# EAGLE design I2CPCB (EAGLE 8.6.0)
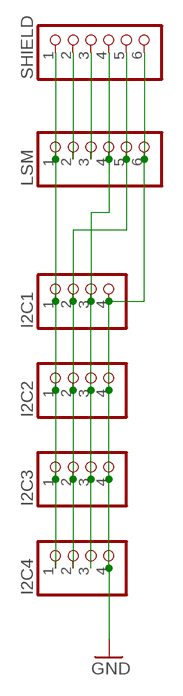
[diagram p0: schematic, sheet 1]

## Parts
I2C1  PINHD-1X4  [1X04]
I2C2  PINHD-1X4  [1X04]
I2C3  PINHD-1X4  [1X04]
I2C4  PINHD-1X4  [1X04]
LSM  PINHD-1X6  [1X06]
SHIELD  PINHD-1X6  [1X06]

## Nets
GND: I2C1.4 I2C2.4 I2C3.4 I2C4.4 LSM.6 SHIELD.6
N$1: I2C1.1 I2C2.1 I2C3.1 I2C4.1 LSM.1 SHIELD.1
N$2: LSM.2 SHIELD.2
N$3: LSM.3 SHIELD.3
N$5: I2C1.2 I2C2.2 I2C3.2 I2C4.2 LSM.5 SHIELD.5
N$6: I2C1.3 I2C2.3 I2C3.3 I2C4.3 LSM.4 SHIELD.4

## Library data of the parts
I2C1-I2C4 = pinhead:PINHD-1X4: PIN HEADER
LSM SHIELD = pinhead:PINHD-1X6: PIN HEADER

## Board
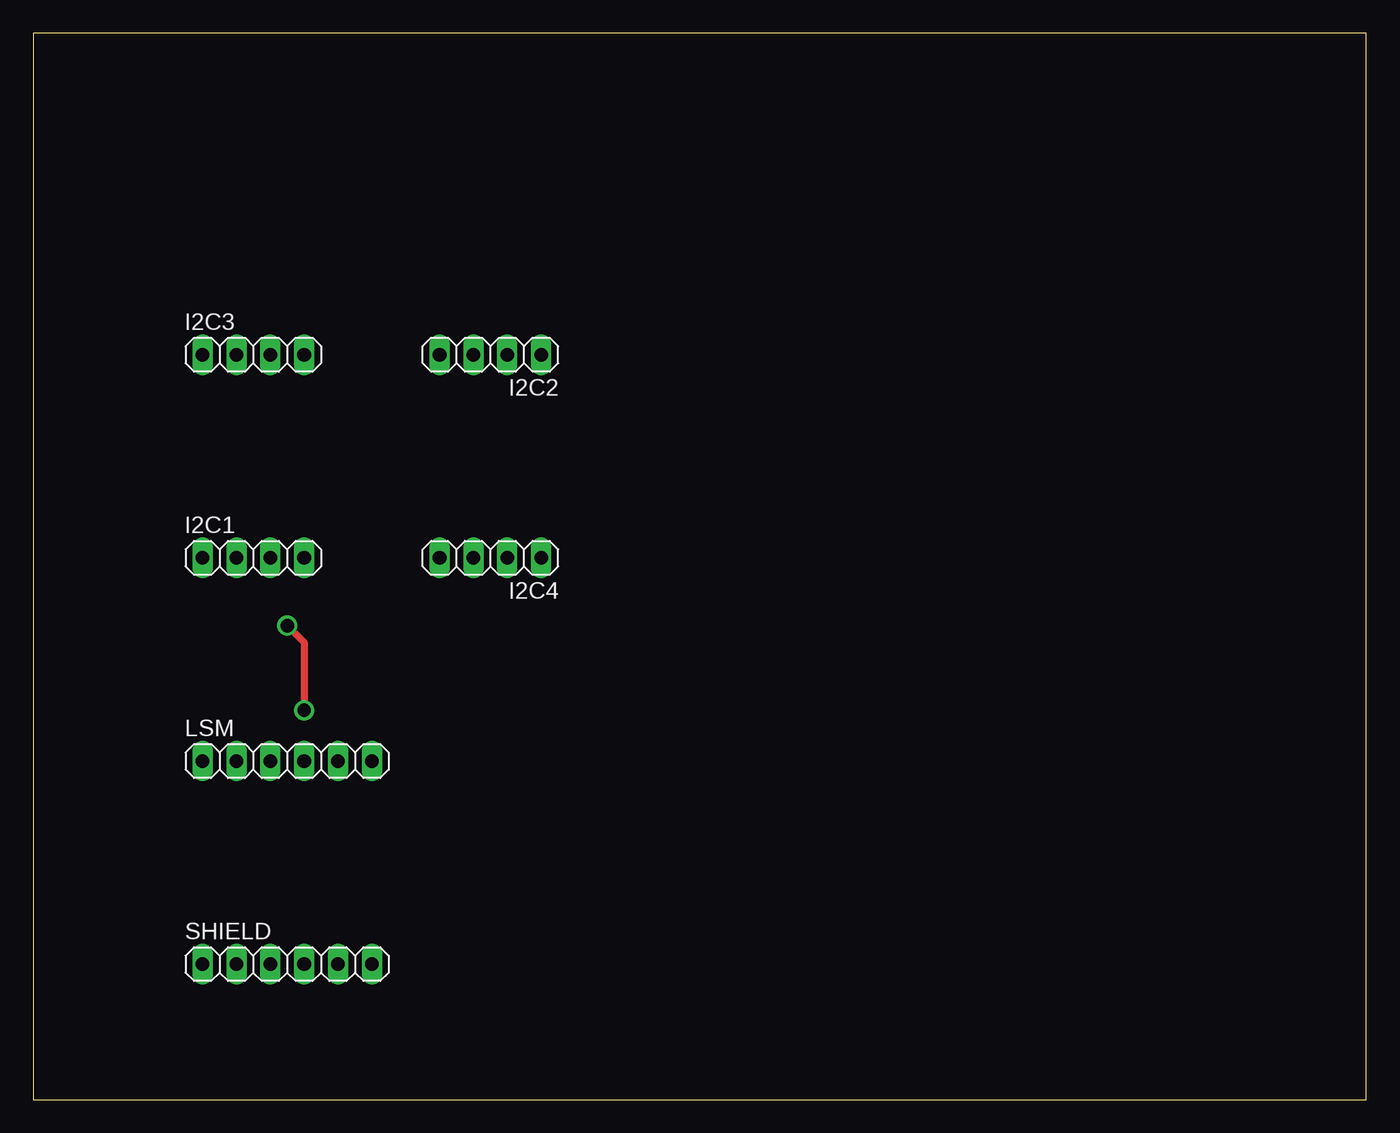
[diagram p1: board, top side]
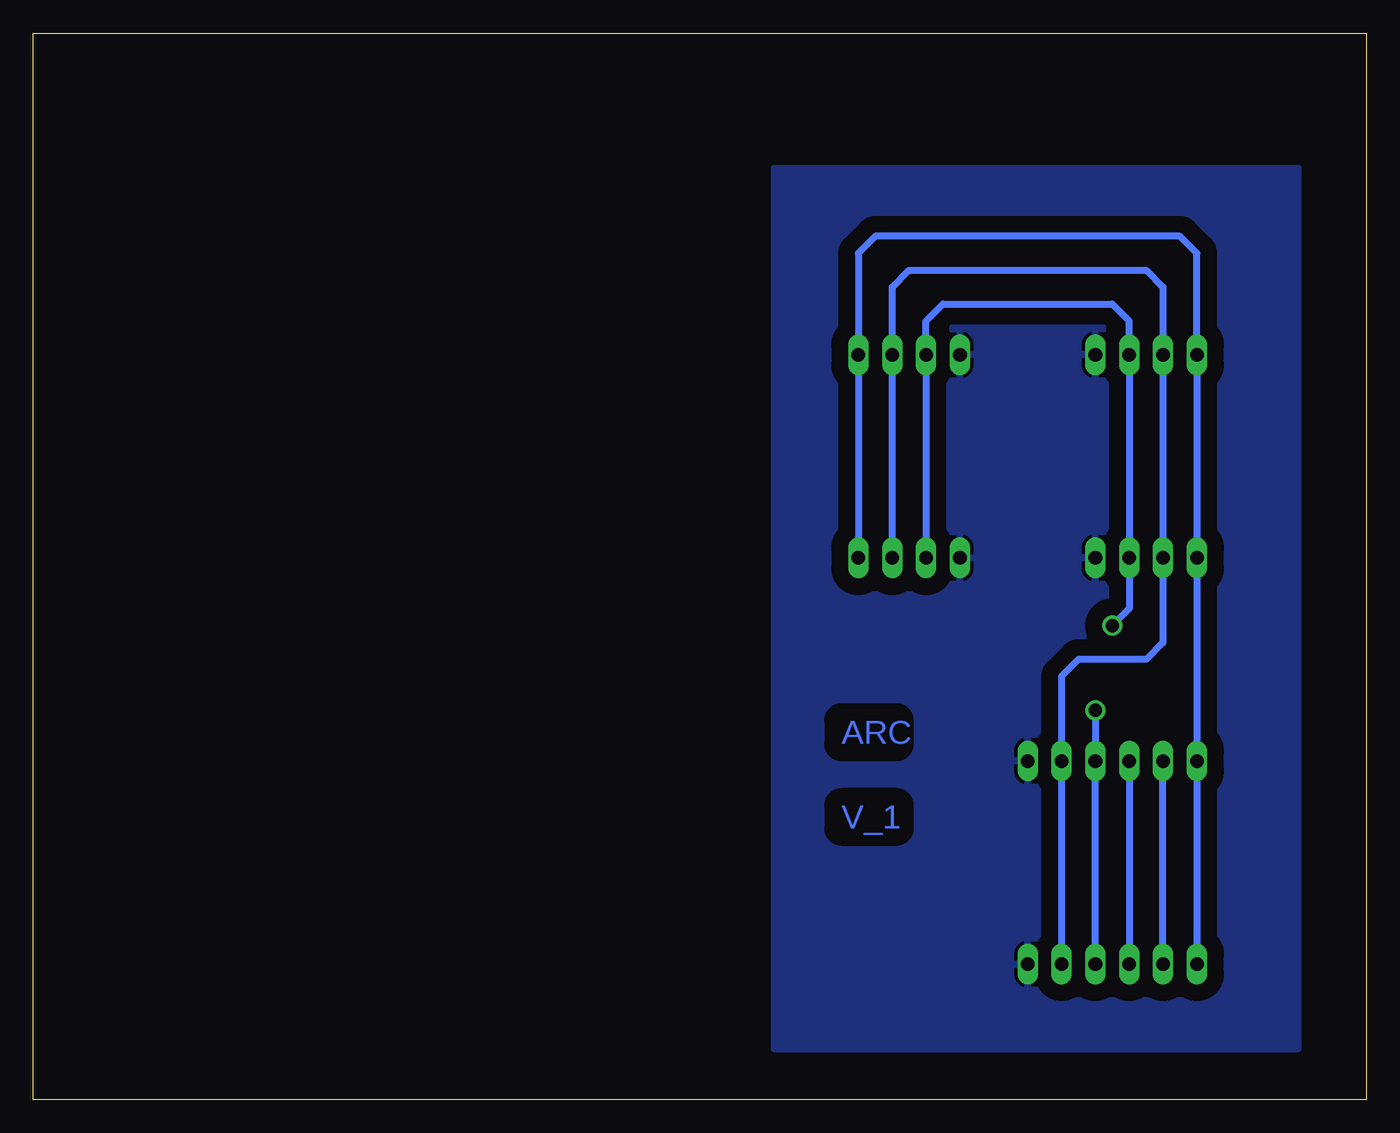
[diagram p2: board, bottom side, seen from below]

Size 100 x 80 mm. Coordinates in mm from the lower left corner, seen from the top.
Outline: 0,0 100,0 100,80 0,80 0,0
Copper layers (1*16): Top 0.035mm / dielectric 1.5mm / Bottom 0.035mm
Design rules "default": minimum track width 6mil, minimum drill 0.35mm, track to track 6mil, track to pad 6mil, pad to pad 6mil, via to via 6mil, smd to smd 6mil, copper to edge 40mil, drill to drill 6mil, minimum pad ring 10mil, minimum via ring 8mil, stop-mask expansion 4mil, vias tented up to drill 0mil, thermal gap 10mil

### Footprints (pad centres in the part's own frame; a part is rotated, then mirrored left to right if it is on the bottom)
1X04 = drill 1.016 long: 1 -3.81,0; 2 -1.27,0; 3 1.27,0; 4 3.81,0
1X06 = drill 1.016 long: 1 -6.35,0; 2 -3.81,0; 3 -1.27,0; 4 1.27,0; 5 3.81,0; 6 6.35,0

### Placement (x,y rotation side)
I2C1  16.51,40.64 0 top
I2C2  34.29,55.88 180 top
I2C3  16.51,55.88 0 top
I2C4  34.29,40.64 180 top
LSM  19.05,25.4 0 top
SHIELD  19.05,10.16 0 top

### Tracks (layer width: path | path; a pad name or v marks a point on that pad's centre or on a via)
GND
  pour Bottom (isolate 1.27): 6.35,69.85 44.45,69.85 44.45,3.81 5.08,3.81 5.08,69.85
N$1
  Bottom 0.508: SHIELD.1 LSM.1 I2C1.1 I2C3.1 12.7,63.5 13.97,64.77 36.83,64.77 38.1,63.5 I2C2.1 I2C4.1
N$2
  Bottom 0.508: SHIELD.2 LSM.2
N$3
  Bottom 0.508: LSM.3 SHIELD.3
N$5
  Bottom 0.508: SHIELD.5 LSM.5 22.86,31.75 21.59,33.02 16.51,33.02 15.24,34.29 I2C1.2 I2C3.2 15.24,60.96 16.51,62.23 34.29,62.23 35.56,60.96 I2C2.2 I2C4.2
N$6  (via drill 1 pad 1.3)
  Top 0.508: v19.05,35.56 20.32,34.29 v20.32,29.21
  Bottom 0.508: SHIELD.4 LSM.4 v20.32,29.21 | I2C4.3 I2C2.3 33.02,58.42 31.75,59.69 19.05,59.69 17.78,58.42 I2C3.3 I2C1.3 17.78,36.83 v19.05,35.56

### Text on the board
Bottom: ARC | V_1